# Altium project ATACS.PrjPcb
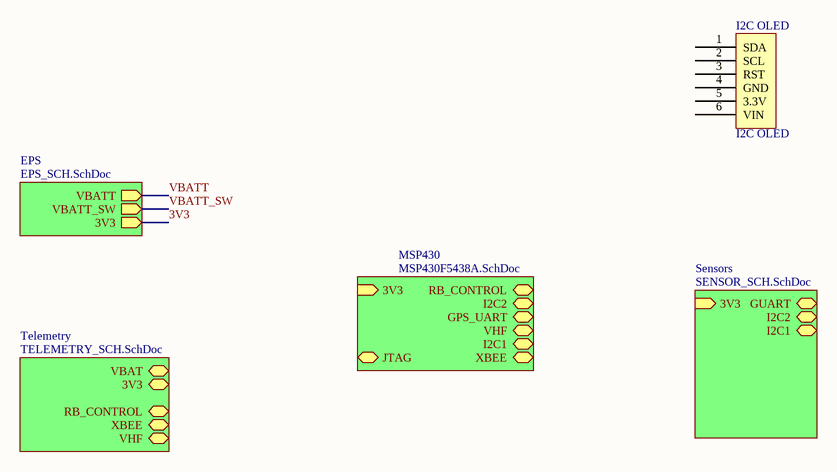
[diagram p0: ATACS_SCH.SchDoc]
5 sheets, 58 parts. Net scope: hierarchical (ports join the sheet entries above them; power ports are global).
Sheets:
  ATACS_SCH.SchDoc
    MSP430 = MSP430F5438A.SchDoc
    EPS = EPS_SCH.SchDoc
    Sensors = SENSOR_SCH.SchDoc
    Telemetry = TELEMETRY_SCH.SchDoc

## Sheet ATACS_SCH.SchDoc
size A

### Parts
I2C_OLED  I2C OLED

### Sub-sheets
EPS = EPS_SCH.SchDoc: 3V3 (out), VBATT (out), VBATT_SW (out)
MSP430 = MSP430F5438A.SchDoc: RB_CONTROL (harness RockBLOCK), I2C2 (harness I2C), GPS_UART (harness UART), JTAG (harness JTAG), VHF (harness APRS Transmitter), I2C1 (harness I2C), XBEE (harness Short-Range XBee), 3V3 (in)
Sensors = SENSOR_SCH.SchDoc: 3V3 (in), GUART (harness Harness), I2C2 (harness I2C), I2C1 (harness I2C)
Telemetry = TELEMETRY_SCH.SchDoc: VBAT, RB_CONTROL (harness Harness), XBEE (harness Harness), 3V3, VHF (harness Harness)

### Nets

Not connected (* = marked no-connect by the designer): I2C_OLED 1(SDA) 2(SCL) 3(RST) 4(GND) 5(3.3V) 6(VIN)

### Library data of the parts
I2C_OLED = I2C OLED: Adafruit 931

## Sheet MSP430F5438A.SchDoc: MSP430F5438A
size B; Author: Justin Shetty; Organization: University of Michigan; Address1: 1320 Beal Avenue; Address2: Ann Arbor, MI 48109; DocumentNumber: 8; Revision: v1.0; SheetNumber: 8; SheetTotal: 19
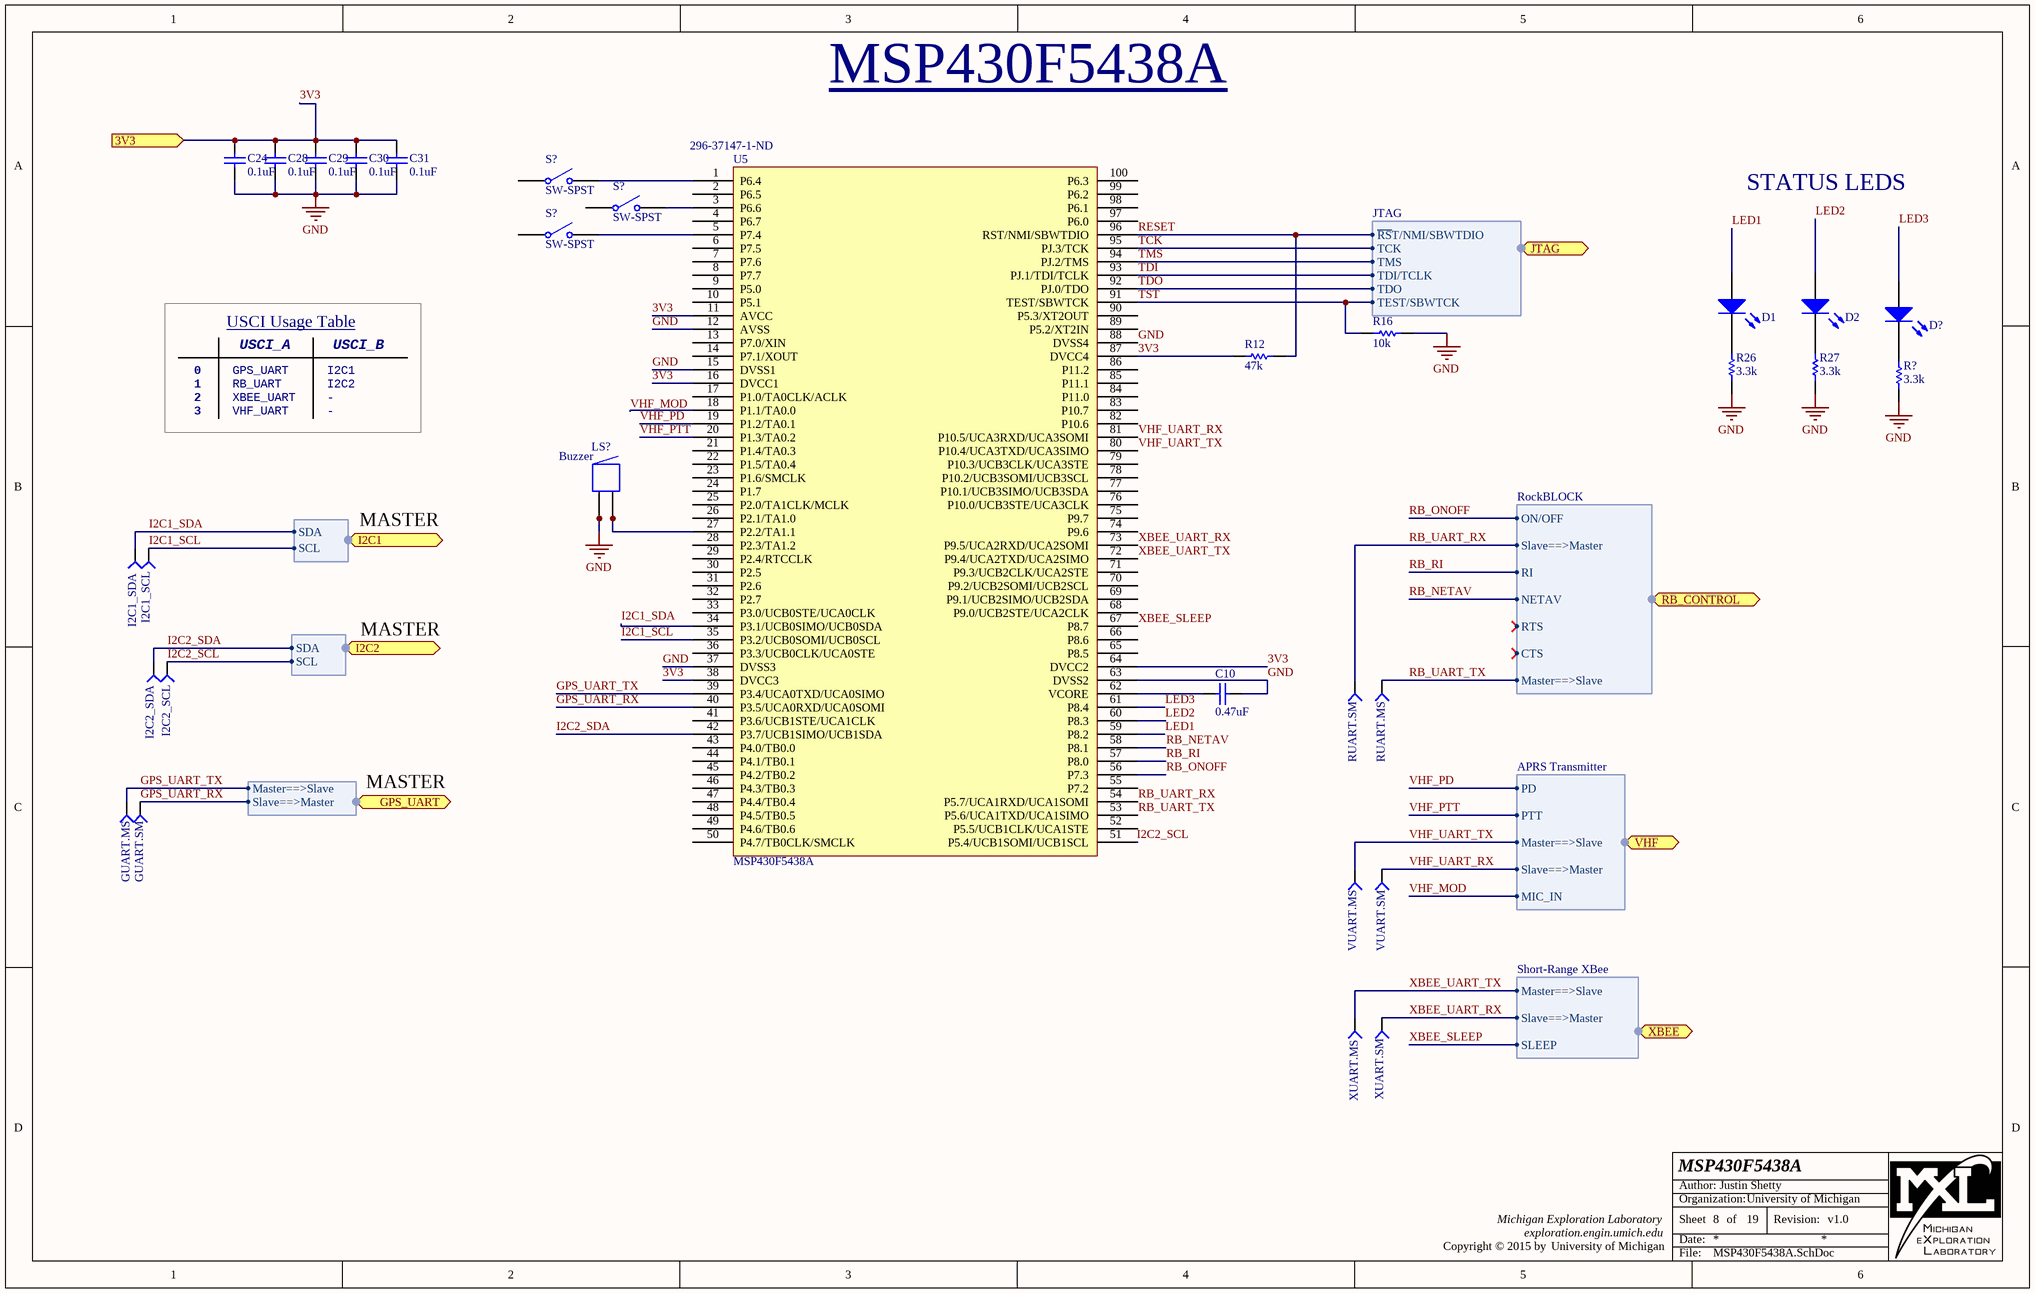
[diagram p1: MSP430F5438A.SchDoc]

### Parts
(Parts that share a designator on the sheet are numbered #1, #2 ... from top to bottom, then left to right.)
C10  value 0.47uF  [0603]  (hidden comment: Capacitor Ceramic)
C24  value 0.1uF  [0603]  (hidden comment: Capacitor Ceramic)
C28  value 0.1uF  [0603]  (hidden comment: Capacitor Ceramic)
C29  value 0.1uF  [0603]  (hidden comment: Capacitor Ceramic)
C30  value 0.1uF  [0603]  (hidden comment: Capacitor Ceramic)
C31  value 0.1uF  [0603]  (hidden comment: Capacitor Ceramic)
D1  LED  [0603P]  (value not drawn)
D2  LED  [0603P]  (value not drawn)
D?  LED  [0603P]  (value not drawn)
GUART.MS  Testpoint  [TESTPOINT]  (value not drawn)  (no BOM)
GUART.SM  Testpoint  [TESTPOINT]  (value not drawn)  (no BOM)
I2C1_SCL  Testpoint  [TESTPOINT]  (value not drawn)  (no BOM)
I2C1_SDA  Testpoint  [TESTPOINT]  (value not drawn)  (no BOM)
I2C2_SCL  Testpoint  [TESTPOINT]  (value not drawn)  (no BOM)
I2C2_SDA  Testpoint  [TESTPOINT]  (value not drawn)  (no BOM)
LS?  Buzzer  [ABSM-1574]
R12  value 47k  [0603]  (hidden comment: Resistor)
R16  value 10k  [0603]  (hidden comment: Resistor)
R26  value 3.3k  [0603]  (hidden comment: Resistor)
R27  value 3.3k  [0603]  (hidden comment: Resistor)
R?#1  value 3.3k  [0603]  (hidden comment: Resistor)
RUART.MS  Testpoint  [TESTPOINT]  (value not drawn)  (no BOM)
RUART.SM  Testpoint  [TESTPOINT]  (value not drawn)  (no BOM)
S?#1  SW-SPST  [SPST-2]
S?#2  SW-SPST  [SPST-2]
S?#3  SW-SPST  [SPST-2]
U5  MSP430F5438A  Supplier Part Number 1: 296-37147-1-ND  [TSQFP50P1600X1600X160-100L]
VUART.MS  Testpoint  [TESTPOINT]  (value not drawn)  (no BOM)
VUART.SM  Testpoint  [TESTPOINT]  (value not drawn)  (no BOM)
XUART.MS  Testpoint  [TESTPOINT]  (value not drawn)  (no BOM)
XUART.SM  Testpoint  [TESTPOINT]  (value not drawn)  (no BOM)

### Ports
3V3 (in), GPS_UART (harness UART), I2C1 (harness I2C), I2C2 (harness I2C), JTAG (harness JTAG), RB_CONTROL (harness RockBLOCK), VHF (harness APRS Transmitter), XBEE (harness Short-Range XBee)

### Harnesses
JTAG: ~{RS}T/NMI/SBWTDIO, TCK, TDI/TCLK, TDO, TEST/SBWTCK, TMS
I2C: SDA, SCL
UART: Master==>Slave, Slave==>Master
RockBLOCK: ON/OFF, Slave==>Master, RI, NETAV, RTS, CTS, Master==>Slave
APRS Transmitter: PD, PTT, Master==>Slave, Slave==>Master, MIC_IN
Short-Range XBee: Master==>Slave, Slave==>Master, SLEEP

### Nets
GND: C10.2 C24.1 C28.1 C29.1 C30.1 C31.1 LS?.1 LS?.1A R16.2 R26.1 R27.1 R?#1.1 U5.12(AVSS) U5.15(DVSS1) U5.37(DVSS3) U5.63(DVSS2) U5.88(DVSS4)
3V3: C24.2 C28.2 C29.2 C30.2 C31.2 R12.1 U5.11(AVCC) U5.16(DVCC1) U5.38(DVCC3) U5.64(DVCC2) U5.87(DVCC4) ; port 3V3
GPS_UART_RX: GUART.SM.1 U5.40(P3.5/UCA0RXD/UCA0SOMI) ; port GPS_UART.Slave==>Master
GPS_UART_TX: GUART.MS.1 U5.39(P3.4/UCA0TXD/UCA0SIMO) ; port GPS_UART.Master==>Slave
I2C1_SCL: I2C1_SCL.1 U5.35(P3.2/UCB0SOMI/UCB0SCL) ; port I2C1.SCL
I2C1_SDA: I2C1_SDA.1 U5.34(P3.1/UCB0SIMO/UCB0SDA) ; port I2C1.SDA
I2C2_SCL: I2C2_SCL.1 U5.51(P5.4/UCB1SOMI/UCB1SCL) ; port I2C2.SCL
I2C2_SDA: I2C2_SDA.1 U5.42(P3.7/UCB1SIMO/UCB1SDA) ; port I2C2.SDA
LED1: D1.2(K) U5.59(P8.2)
LED2: D2.2(K) U5.60(P8.3)
LED3: D?.2(K) U5.61(P8.4)
RB_NETAV: U5.58(P8.1) ; port RB_CONTROL.NETAV
RB_ONOFF: U5.56(P7.3) ; port RB_CONTROL.ON/OFF
RB_RI: U5.57(P8.0) ; port RB_CONTROL.RI
RB_UART_RX: RUART.SM.1 U5.54(P5.7/UCA1RXD/UCA1SOMI) ; port RB_CONTROL.Slave==>Master
RB_UART_TX: RUART.MS.1 U5.53(P5.6/UCA1TXD/UCA1SIMO) ; port RB_CONTROL.Master==>Slave
RESET: R12.2 U5.96(RST/NMI/SBWTDIO) ; port JTAG.~{RS}T/NMI/SBWTDIO
TCK: U5.95(PJ.3/TCK) ; port JTAG.TCK
TDI: U5.93(PJ.1/TDI/TCLK) ; port JTAG.TDI/TCLK
TDO: U5.92(PJ.0/TDO) ; port JTAG.TDO
TMS: U5.94(PJ.2/TMS) ; port JTAG.TMS
TST: R16.1 U5.91(TEST/SBWTCK) ; port JTAG.TEST/SBWTCK
VHF_MOD: U5.18(P1.1/TA0.0) ; port VHF.MIC_IN
VHF_PD: U5.19(P1.2/TA0.1) ; port VHF.PD
VHF_PTT: U5.20(P1.3/TA0.2) ; port VHF.PTT
VHF_UART_RX: U5.81(P10.5/UCA3RXD/UCA3SOMI) VUART.SM.1 ; port VHF.Slave==>Master
VHF_UART_TX: U5.80(P10.4/UCA3TXD/UCA3SIMO) VUART.MS.1 ; port VHF.Master==>Slave
XBEE_SLEEP: U5.67(P8.7) ; port XBEE.SLEEP
XBEE_UART_RX: U5.73(P9.5/UCA2RXD/UCA2SOMI) XUART.SM.1 ; port XBEE.Slave==>Master
XBEE_UART_TX: U5.72(P9.4/UCA2TXD/UCA2SIMO) XUART.MS.1 ; port XBEE.Master==>Slave
NetC10_1: C10.1 U5.62(VCORE)
NetD1_1: D1.1(A) R26.2
NetD2_1: D2.1(A) R27.2
NetD?_1: D?.1(A) R?#1.2
NetLS?_2: LS?.2 LS?.2A U5.27(P2.2/TA1.1)
NetS?#1_2: S?#1.2(NO) U5.1(P6.4)
NetS?#2_2: S?#2.2(NO) U5.3(P6.6)
NetS?#3_2: S?#3.2(NO) U5.5(P7.4)

Not connected (* = marked no-connect by the designer): S?#1 1(COMMON); S?#2 1(COMMON); S?#3 1(COMMON); U5 2(P6.5) 4(P6.7) 6(P7.5) 7(P7.6) 8(P7.7) 9(P5.0) 10(P5.1) 13(P7.0/XIN) 14(P7.1/XOUT) 17(P1.0/TA0CLK/ACLK) 21(P1.4/TA0.3) 22(P1.5/TA0.4) 23(P1.6/SMCLK) 24(P1.7) 25(P2.0/TA1CLK/MCLK) 26(P2.1/TA1.0) 28(P2.3/TA1.2) 29(P2.4/RTCCLK) 30(P2.5) 31(P2.6) 32(P2.7) 33(P3.0/UCB0STE/UCA0CLK) 36(P3.3/UCB0CLK/UCA0STE) 41(P3.6/UCB1STE/UCA1CLK) 43(P4.0/TB0.0) 44(P4.1/TB0.1) 45(P4.2/TB0.2) 46(P4.3/TB0.3) 47(P4.4/TB0.4) 48(P4.5/TB0.5) 49(P4.6/TB0.6) 50(P4.7/TB0CLK/SMCLK) 52(P5.5/UCB1CLK/UCA1STE) 55(P7.2) 65(P8.5) 66(P8.6) 68(P9.0/UCB2STE/UCA2CLK) 69(P9.1/UCB2SIMO/UCB2SDA) 70(P9.2/UCB2SOMI/UCB2SCL) 71(P9.3/UCB2CLK/UCA2STE) 74(P9.6) 75(P9.7) 76(P10.0/UCB3STE/UCA3CLK) 77(P10.1/UCB3SIMO/UCB3SDA) 78(P10.2/UCB3SOMI/UCB3SCL) 79(P10.3/UCB3CLK/UCA3STE) 82(P10.6) 83(P10.7) 84(P11.0) 85(P11.1) 86(P11.2) 89(P5.2/XT2IN) 90(P5.3/XT2OUT) 97(P6.0) 98(P6.1) 99(P6.2) 100(P6.3)

### Notes on the sheet
- MSP430F5438A
- STATUS LEDS
- USCI_A
- USCI Usage Table
- USCI_B
- 1
- 2
- 0
- 3
- GPS_UART
- XBEE_UART
- RB_UART
- VHF_UART
- I2C1
- -
- I2C2
- MASTER
- Michigan Exploration Laboratory
- exploration.engin.umich.edu
- Date:
- Sheet
- Author:
- Organization:
- of
- University of Michigan
- Revision:
- Copyright © 2015 by
- File:

### Library data of the parts
GUART.MS GUART.SM I2C1_SCL I2C1_SDA I2C2_SCL I2C2_SDA RUART.MS RUART.SM VUART.MS VUART.SM XUART.MS XUART.SM = Testpoint: Probe point for testing
LS? = Buzzer: Magnetic Transducer Buzzer; Published: 24-Mar-1999; LatestRevisionDate: 17-Dec-2003; LatestRevisionNote: Schematic revised, PCB Footprint replaced.; DatasheetVersion: 17-Dec-2003; PackageReference: ABSM-1574; Publisher: Altium Limited; PackageDescription: Magnetic Transducer Buzzer; ComponentLink1Description: Manufacturer Link; ComponentLink1URL: http://www.megastar.com/linecard/buzzmode/index.php
R12 R16 R26 R27 R?#1 = Resistor: Resistive element
S?#1-S?#3 = SW-SPST: Single-Pole, Single-Throw Switch; Published: 24-Mar-1999; LatestRevisionDate: 17-Jul-2002; LatestRevisionNote: Re-released for DXP Platform.; PackageReference: SPST-2; Publisher: Altium Limited; PackageDescription: Switch; 2 Leads
U5 = MSP430F438IPZ: Manufacturer: Texas Instruments; Manufacturer Part Number: MSP430F5438AIPZR; Core Processor: MSP430; Core Size: 16-Bit; Speed: 25MHz; Connectivity: I²C, IrDA, LIN, SCI, SPI, UART/USART; Peripherals: Brown-out Detect/Reset, DMA, POR, PWM, WDT; Number of I/O: 87; Program Memory Size: 256KB (256K x 8); Program Memory Type: FLASH; RAM Size: 16K x 8; Voltage - Supply (Vcc/Vdd): 1.8 V ~ 3.6 V; Data Converters: A/D 16x12b; Oscillator Type: Internal; Digikey: 296-37147-1-ND; Supplier 1: Digi-Key; RoHS: RoHS Compliant; Category: Integrated Circuits (ICs); Stock 1: 6499; Pricing 1: 1=10.57, 10=9.5, 25=8.6404, 100=7.8215, 250=7.16624, 500=6.552, 750=6.01965, 1000=5.11875 (USD); Packaging: Cut Tape (CT); EEPROM Size: -; Operating Temperature: -40°C ~ 85°C; Package / Case: 100-LQFP; Supplier Device Package: 100-LQFP (14x14); ComponentLink1URL: http://www.ti.com/lit/ds/symlink/msp430f5418a.pdf; ComponentLink1Description: http://www.ti.com/lit/ds/symlink/msp430f5418a.pdf

## Sheet EPS_SCH.SchDoc
size A
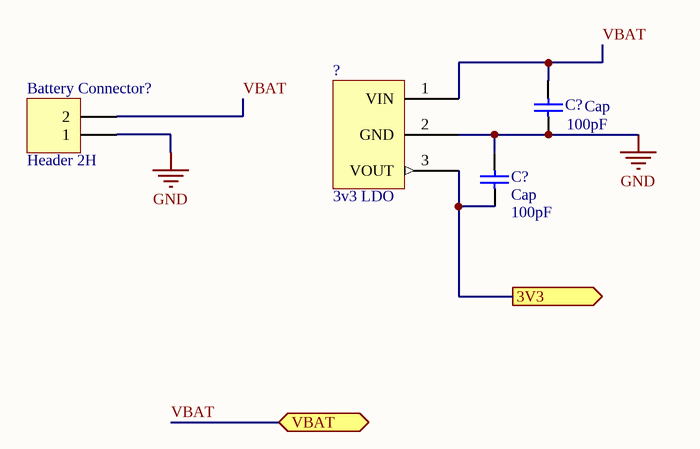
[diagram p2: EPS_SCH.SchDoc]

### Parts
(Parts that share a designator on the sheet are numbered #1, #2 ... from top to bottom, then left to right.)
?  3v3 LDO
Battery_Connector?  Header 2H  [HDR1X2H]
C?#1  Cap  value 100pF  [RAD-0.3]
C?#2  Cap  value 100pF  [RAD-0.3]

### Ports
3V3 (out), VBAT

### Nets
GND: ?.2(GND) Battery_Connector?.1 C?#1.1 C?#2.2
3V3: ?.3(VOUT) C?#2.1 ; port 3V3
VBAT: ?.1(VIN) Battery_Connector?.2 C?#1.2 ; port VBAT

### Library data of the parts
? = 3v3 LDO: MCP1826S-3302E/AB
Battery_Connector? = Header 2H: Header, 2-Pin, Right Angle; LatestRevisionDate: 17-Jul-2002; LatestRevisionNote: Re-released for DXP Platform.; Publisher: Altium Limited
C?#1 C?#2 = Cap: Capacitor; Published: 8-Jun-2000; LatestRevisionDate: 17-Jul-2002; LatestRevisionNote: Re-released for DXP Platform.; PackageReference: RAD-0.3; Publisher: Altium Limited; PackageDescription: Radial Cap, Thru-Hole; 2 Leads; 0.3 in Pin Spacing

## Sheet SENSOR_SCH.SchDoc
size A
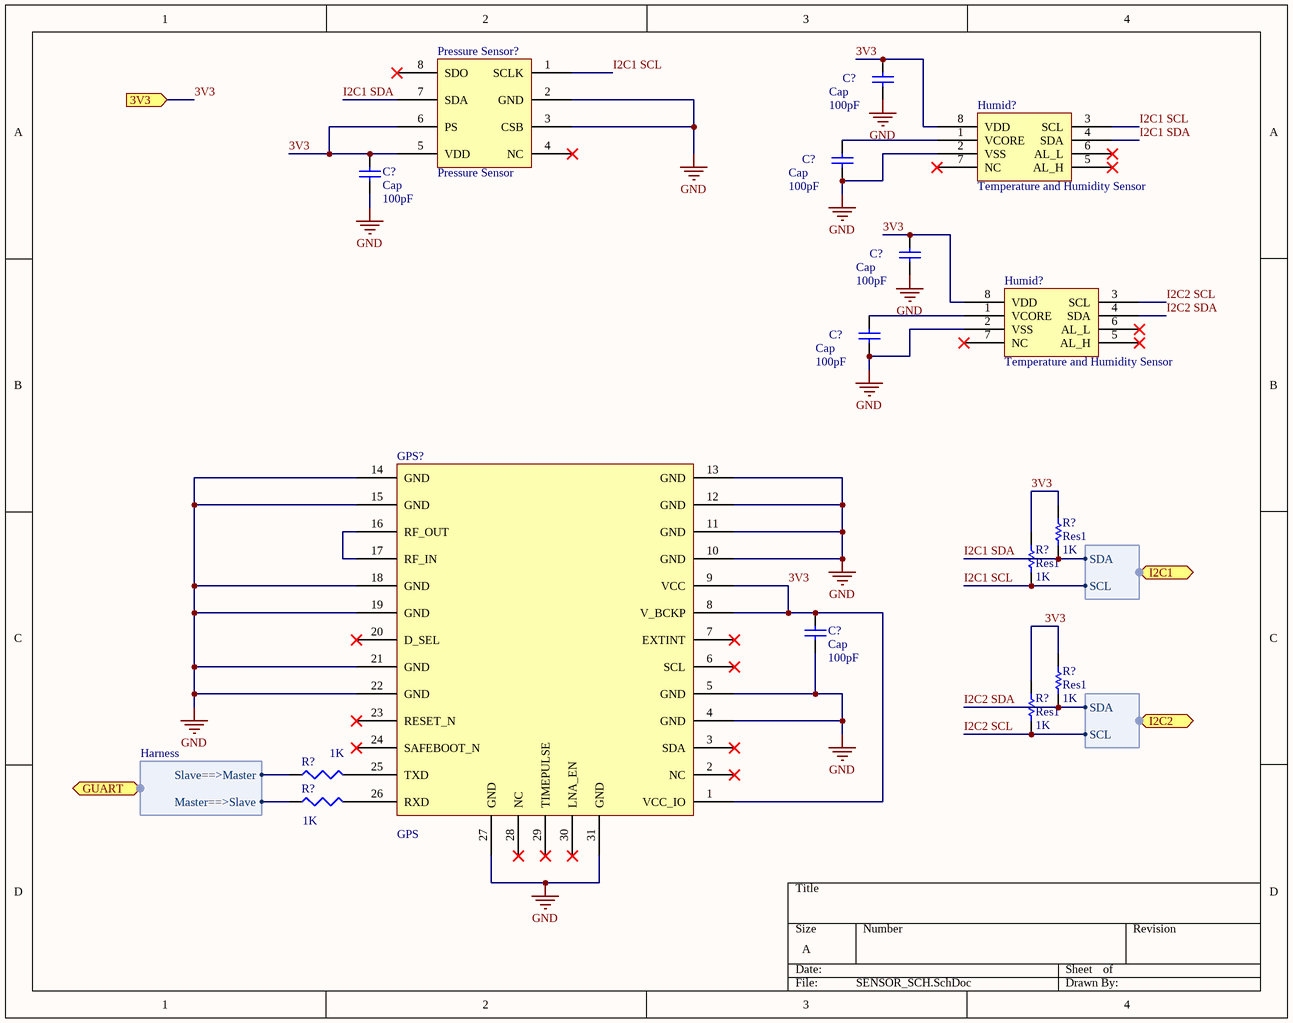
[diagram p3: SENSOR_SCH.SchDoc]

### Parts
(Parts that share a designator on the sheet are numbered #1, #2 ... from top to bottom, then left to right.)
C?#3  Cap  value 100pF  [RAD-0.3]
C?#4  Cap  value 100pF  [RAD-0.3]
C?#5  Cap  value 100pF  [RAD-0.3]
C?#6  Cap  value 100pF  [RAD-0.3]
C?#7  Cap  value 100pF  [RAD-0.3]
C?#8  Cap  value 100pF  [RAD-0.3]
GPS?  GPS
Humid?#1  Temperature and Humidity Sensor
Humid?#2  Temperature and Humidity Sensor
Pressure_Sensor?  Pressure Sensor
R?#2  Res1  value 1K  [AXIAL-0.3]
R?#3  Res1  value 1K  [AXIAL-0.3]
R?#4  Res1  value 1K  [AXIAL-0.3]
R?#5  Res1  value 1K  [AXIAL-0.3]
R?#6  value 1K  [J1-0603]  (hidden comment: Res3)
R?#7  value 1K  [J1-0603]  (hidden comment: Res3)

### Ports
3V3 (in), GUART (harness Harness), I2C1 (harness I2C), I2C2 (harness I2C)

### Harnesses
Harness: Slave==>Master, Master==>Slave
I2C: SDA, SCL

### Nets
GND: C?#3.1 C?#4.1 C?#5.1 C?#6.1 C?#7.1 C?#8.1 GPS?.4(GND) GPS?.5(GND) GPS?.10(GND) GPS?.11(GND) GPS?.12(GND) GPS?.13(GND) GPS?.14(GND) GPS?.15(GND) GPS?.18(GND) GPS?.19(GND) GPS?.21(GND) GPS?.22(GND) GPS?.27(GND) GPS?.31(GND) Humid?#1.2(VSS) Humid?#2.2(VSS) Pressure_Sensor?.2(GND) Pressure_Sensor?.3(CSB)
3V3: C?#3.2 C?#5.2 C?#6.2 C?#8.2 GPS?.1(VCC_IO) GPS?.8(V_BCKP) GPS?.9(VCC) Humid?#1.8(VDD) Humid?#2.8(VDD) Pressure_Sensor?.5(VDD) Pressure_Sensor?.6(PS) R?#2.2 R?#3.2 R?#4.2 R?#5.2 ; port 3V3
I2C1 SCL: Humid?#1.3(SCL) Pressure_Sensor?.1(SCLK) R?#3.1 ; port I2C1.SCL
I2C1 SDA: Humid?#1.4(SDA) Pressure_Sensor?.7(SDA) R?#2.1 ; port I2C1.SDA
I2C2 SCL: Humid?#2.3(SCL) R?#5.1 ; port I2C2.SCL
I2C2 SDA: Humid?#2.4(SDA) R?#4.1 ; port I2C2.SDA
NetC?#4_2: C?#4.2 Humid?#1.1(VCORE)
NetC?#7_2: C?#7.2 Humid?#2.1(VCORE)
NetGPS?_16: GPS?.16(RF_OUT) GPS?.17(RF_IN)
NetGPS?_25: GPS?.25(TXD) R?#6.2
NetGPS?_26: GPS?.26(RXD) R?#7.2
NetR?#6_1: R?#6.1 ; port GUART.Slave==>Master
NetR?#7_1: R?#7.1 ; port GUART.Master==>Slave

Not connected (* = marked no-connect by the designer): GPS? 2(NC)* 3(SDA)* 6(SCL)* 7(EXTINT)* 20(D_SEL)* 23(RESET_N)* 24(SAFEBOOT_N)* 28(NC)* 29(TIMEPULSE)* 30(LNA_EN)*; Humid?#1 5(AL_H)* 6(AL_L)* 7(NC)*; Humid?#2 5(AL_H)* 6(AL_L)* 7(NC)*; Pressure_Sensor? 4(NC)* 8(SDO)*

### Library data of the parts
C?#3-C?#8 = Cap: Capacitor; Published: 8-Jun-2000; LatestRevisionDate: 17-Jul-2002; LatestRevisionNote: Re-released for DXP Platform.; PackageReference: RAD-0.3; Publisher: Altium Limited; PackageDescription: Radial Cap, Thru-Hole; 2 Leads; 0.3 in Pin Spacing
GPS? = GPS: CAM M8C
Humid?#1 Humid?#2 = Temperature and Humidity Sensor: HIH6030-021-001
Pressure_Sensor? = Pressure Sensor: MS580301BA01-00
R?#2-R?#5 = Res1: Resistor; Published: 8-Jun-2000; LatestRevisionDate: 17-Jul-2002; LatestRevisionNote: Re-released for DXP Platform.; PackageReference: AXIAL-0.3; Publisher: Altium Limited; PackageDescription: Axial Device, Thru-Hole; 2 Leads; 0.3 in Pin Spacing
R?#6 R?#7 = Res3: Resistor; Published: 8-Jun-2000; LatestRevisionDate: 29-May-2009; LatestRevisionNote: IPC-7351 Footprint Added.; PackageReference: J1-0603; Publisher: Altium Limited; PackageDescription: Chip Resistor

## Sheet TELEMETRY_SCH.SchDoc
size A
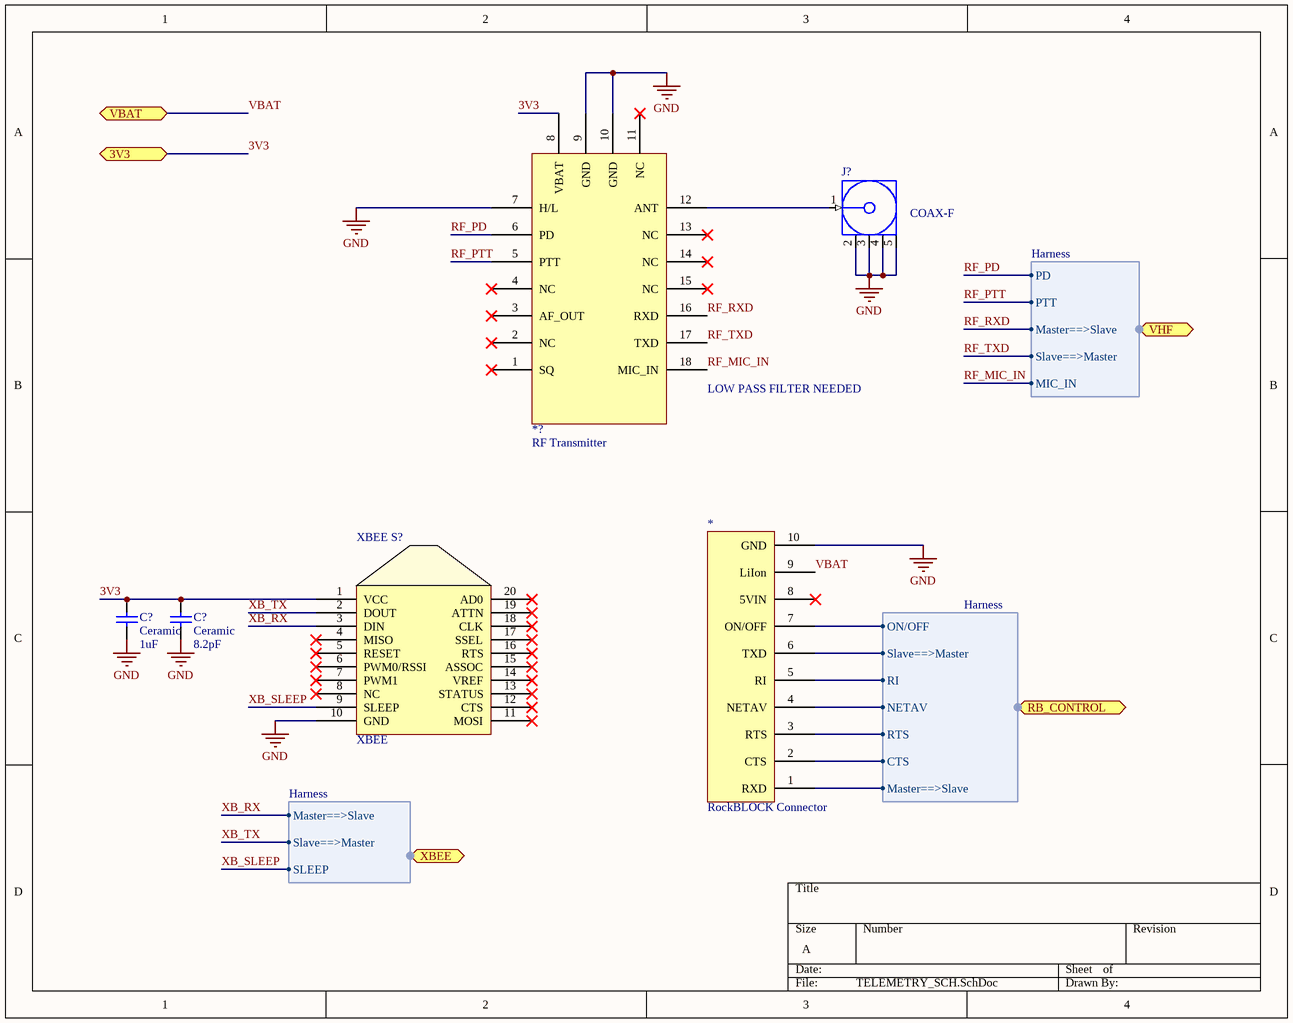
[diagram p4: TELEMETRY_SCH.SchDoc]

### Parts
(Parts that share a designator on the sheet are numbered #1, #2 ... from top to bottom, then left to right.)
*  RockBLOCK Connector
*?  RF Transmitter
C?#9  Ceramic  value 1uF  [RAD-0.3]
C?#10  Ceramic  value 8.2pF  [RAD-0.3]
J?  COAX-F  [MCX5.08-H5]
XBEE_S?  XBEE

### Ports
3V3, RB_CONTROL (harness Harness), VBAT, VHF (harness Harness), XBEE (harness Harness)

### Harnesses
Harness: ON/OFF, Slave==>Master, RI, NETAV, RTS, CTS, Master==>Slave
Harness: PD, PTT, Master==>Slave, Slave==>Master, MIC_IN
Harness: Master==>Slave, Slave==>Master, SLEEP

### Nets
GND: *.10(GND) *?.7(H/L) *?.9(GND) *?.10(GND) C?#9.1 C?#10.1 J?.2(GND) J?.3(GND) J?.4(GND) J?.5(GND) XBEE_S?.10(GND)
3V3: *?.8(VBAT) C?#9.2 C?#10.2 XBEE_S?.1(VCC) ; port 3V3
RF_MIC_IN: *?.18(MIC_IN) ; port VHF.MIC_IN
RF_PD: *?.6(PD) ; port VHF.PD
RF_PTT: *?.5(PTT) ; port VHF.PTT
RF_RXD: *?.16(RXD) ; port VHF.Master==>Slave
RF_TXD: *?.17(TXD) ; port VHF.Slave==>Master
VBAT: *.9(LiIon) ; port VBAT
XB_RX: XBEE_S?.3(DIN) ; port XBEE.Master==>Slave
XB_SLEEP: XBEE_S?.9(SLEEP) ; port XBEE.SLEEP
XB_TX: XBEE_S?.2(DOUT) ; port XBEE.Slave==>Master
Net*?_12: *?.12(ANT) J?.1(Signal)
Net*_1: *.1(RXD) ; port RB_CONTROL.Master==>Slave
Net*_2: *.2(CTS) ; port RB_CONTROL.CTS
Net*_3: *.3(RTS) ; port RB_CONTROL.RTS
Net*_4: *.4(NETAV) ; port RB_CONTROL.NETAV
Net*_5: *.5(RI) ; port RB_CONTROL.RI
Net*_6: *.6(TXD) ; port RB_CONTROL.Slave==>Master
Net*_7: *.7(ON/OFF) ; port RB_CONTROL.ON/OFF

Not connected (* = marked no-connect by the designer): * 8(5VIN)*; *? 1(SQ)* 2(NC)* 3(AF_OUT)* 4(NC)* 11(NC)* 13(NC)* 14(NC)* 15(NC)*; XBEE_S? 4(MISO)* 5(RESET)* 6(PWM0/RSSI)* 7(PWM1)* 8(NC)* 11(MOSI)* 12(CTS)* 13(STATUS)* 14(VREF)* 15(ASSOC)* 16(RTS)* 17(SSEL)* 18(CLK)* 19(ATTN)* 20(AD0)*

### Notes on the sheet
- (near *?) LOW PASS FILTER NEEDED

### Library data of the parts
*? = RF Transmitter: DRA818V
C?#9 C?#10 = Cap: Capacitor; Published: 8-Jun-2000; LatestRevisionDate: 17-Jul-2002; LatestRevisionNote: Re-released for DXP Platform.; PackageReference: RAD-0.3; Publisher: Altium Limited; PackageDescription: Radial Cap, Thru-Hole; 2 Leads; 0.3 in Pin Spacing
J? = COAX-F: RF Coaxial PCB Connector, MCX; Thru-Hole, Right-Angle Mount Socket, Blunt Post Terminal, 50 Ohm Impedance; PCB_Layout: Complies with manufacturer's recommendation.; DrillSize: Corresponds to nominal value.; Published: 15-Jul-2004; LatestRevisionDate: 15-Jul-2004; LatestRevisionNote: Component Replaced.; DatasheetDocument: 30-May-2003; PackageDocument: 04-Jul-1999; PackageReference: 919-119J-51AX; Publisher: Altium Limited; ComponentLink1Description: Manufacturer Link; ComponentLink1URL: http://www.amphenolrf.com/
XBEE_S? = XBEE: XB24CZ7WIT-004

## Nets that join several sheets
GND: MSP430F5438A (17 pins), EPS_SCH (?.2 Battery_Connector?.1 C?#1.1 C?#2.2), SENSOR_SCH (24 pins), TELEMETRY_SCH (11 pins)